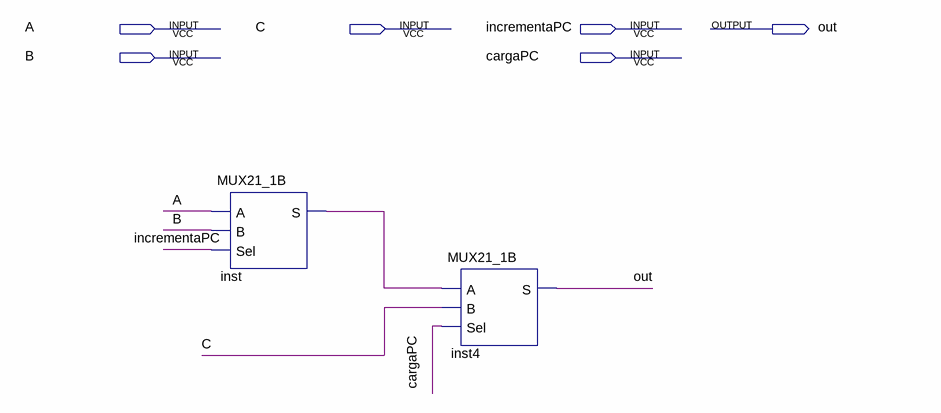
[diagram p0: schematic sheet]
// Quartus schematic MUX41.bdf as structural Verilog: 2 symbols, 6 pins
module MUX41 (
  input  A,
  input  C,
  input  incrementaPC,
  input  B,
  input  cargaPC,
  output out
);

  wire inst_s;

  MUX21_1B inst (.A(A), .B(B), .Sel(incrementaPC), .S(inst_s));
  MUX21_1B inst4 (.A(inst_s), .B(C), .Sel(cargaPC), .S(out));
endmodule
